# Altium schematic sheet USB_conflict-20171010-134611.SchDoc
size A4
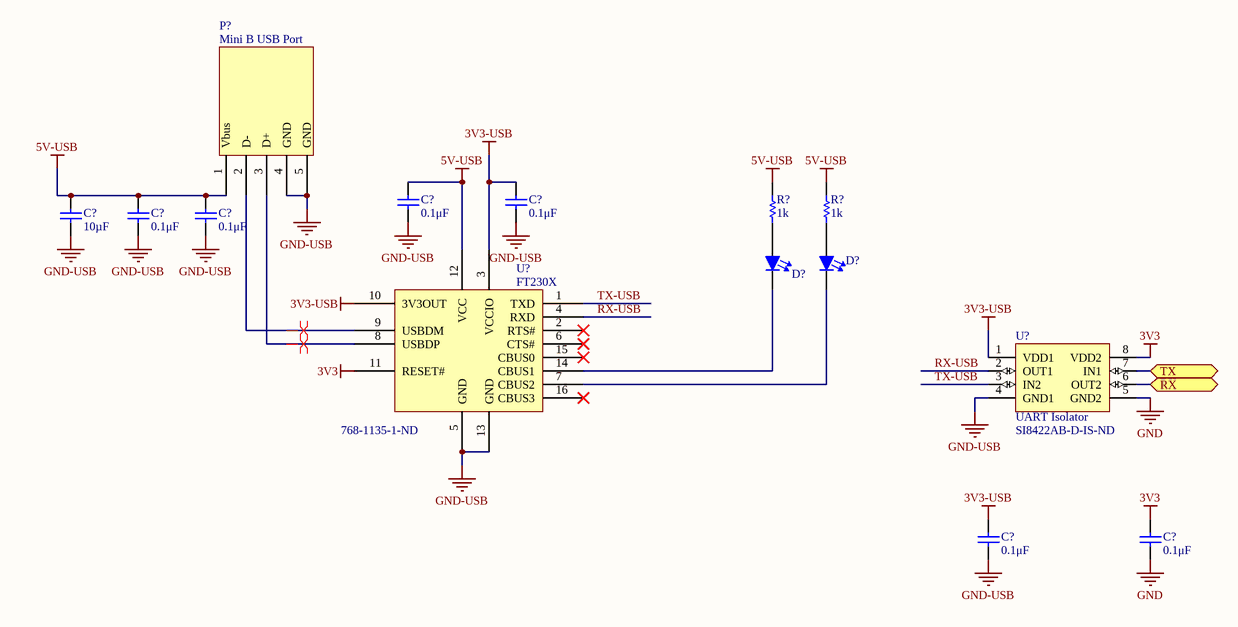
[diagram p0: USB_conflict-20171010-134611.SchDoc]

## Parts
(Parts that share a designator on the sheet are numbered #1, #2 ... from top to bottom, then left to right.)
C?#1  0.1μF  [CAPC1608N(0603")]
C?#2  0.1μF  [CAPC1608N(0603")]
C?#3  0.1μF  [CAPC1608N(0603")]
C?#4  0.1μF  [CAPC1608N(0603")]
C?#5  10µF  [CAPC2012N(0805")]
C?#6  0.1μF  [CAPC1608N(0603")]
C?#7  0.1μF  [CAPC1608N(0603")]
D?#1  Red  [LED0603]  (value not drawn)
D?#2  Red  [LED0603]  (value not drawn)
P?  Mini B USB Port  [Mini B USB Footprint]
R?#1  1k  [RESC1608N(0603")]
R?#2  1k  [RESC1608N(0603")]
U?#1  FT230X  Supplier Part Number 1: 768-1135-1-ND  [SSOP16]
U?#2  UART Isolator  Supplier Part Number 1: SI8422AB-D-IS-ND  [SOIC-SN8_M]

## Ports
RX, TX

## Nets
3V3: C?#7.2(Cathode) U?#1.11(RESET#) U?#2.8(VDD2)
3V3-USB: C?#2.2(Cathode) C?#6.2(Cathode) U?#1.3(VCCIO) U?#1.10(3V3OUT) U?#2.1(VDD1)
5V-USB: C?#1.2(Cathode) C?#3.2(Cathode) C?#4.2(Cathode) C?#5.2(Cathode) P?.1(Vbus) R?#1.2 R?#2.2 U?#1.12(VCC)
GND: C?#7.1(Anode) U?#2.5(GND2)
GND-USB: C?#1.1(Anode) C?#2.1(Anode) C?#3.1(Anode) C?#4.1(Anode) C?#5.1(Anode) C?#6.1(Anode) P?.4(GND) P?.5(GND) U?#1.5(GND) U?#1.13(GND) U?#2.4(GND1)
RX: U?#2.6(OUT2) ; port RX
RX-USB: U?#1.4(RXD) U?#2.2(OUT1)
TX: U?#2.7(IN1) ; port TX
TX-USB: U?#1.1(TXD) U?#2.3(IN2)
NetD?#1_1: D?#1.1(Cathode) U?#1.14(CBUS1)
NetD?#1_2: D?#1.2(Anode) R?#1.1
NetD?#2_1: D?#2.1(Cathode) U?#1.7(CBUS2)
NetD?#2_2: D?#2.2(Anode) R?#2.1
NetP?_2: P?.2(D-) U?#1.9(USBDM)
NetP?_3: P?.3(D+) U?#1.8(USBDP)

Not connected (* = marked no-connect by the designer): U?#1 2(RTS#)* 6(CTS#)* 15(CBUS0)* 16(CBUS3)*

## Layout directives
differential pair: NetP?_2, NetP?_3

## Library data of the parts
C?#1-C?#4 C?#6 C?#7 = 0.1uF 100V 0603 SMD, Ceramic: Capacitor, Ceramic, 100V, +/- 10%, 0603 SMD, X7R; MFG: TDK; MFG#: CGA3E3X7S2A104K080AB; Published: 16-04-26; Publisher: AUVic; PackageDescription: Chip Capacitor; Value: 0.1μF; Created By: Ashwin Sira; Supplier 1: Digi-Key; Supplier Part Number 1: 445-6938-1-ND
C?#5 = 10uF 10V 0805 SMD, Ceramic: Capacitor, Ceramic, 10V, +/- 10%, 0805 SMD, X5R; Made By: Andy Bates; Published: 14-06-23; Publisher: AUVic; PackageDescription: Chip Capacitor; Value: 10µF; Supplier 1: Digi-Key; Supplier Part Number 1: 490-4735-1-ND
D?#1 = LED, 0805 (2012), Red, Clear: Supplier 1: Digi-Key; Supplier Part Number 1: 732-4984-1-ND; Colour: Red; Created By: Ashwin Sira
D?#2 = LED, 0805 (2012), Green, Clear: Colour: Red; Created By: Andy Bates; Supplier 1: Digi-Key; Supplier Part Number 1: 475-1410-1-ND
P? = Mini B USB Port: Mini B USB Port - Female; Created by: Gabriel Green; Created on: July 5, 2017
R?#1 R?#2 = 1kR, 1%, 1/10W , 0603, SMD: Created By: Andy Bates; Publisher: AUVic; Date Created: 2017-05-10; Value: 1k; Supplier 1: Digikey; Supplier Part Number 1: 311-1.00KHRCT-ND
U?#1 = FTDI - USB to UART: Supplier 1: Digi-Key; Created by: Gabriel Green; Created on: July 5th, 2017
U?#2 = UART Isolators 1Mbps 2.7-5.5V: UART Isolators 1/1 1Mbps; Made By: Andy Bates; Created On: 2017/09/10; Supplier 1: Digi-Key